# EAGLE design CapTouchMatrix (EAGLE 9.6.2)
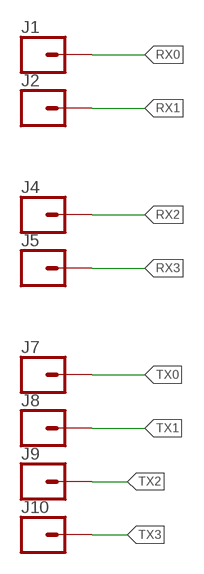
[diagram p0: schematic, sheet 1]

## Parts
J1  CONN_01  [1X01]
J2  CONN_01  [1X01]
J4  CONN_01  [1X01]
J5  CONN_01  [1X01]
J7  CONN_01  [1X01]
J8  CONN_01  [1X01]
J9  CONN_01  [1X01]
J10  CONN_01  [1X01]

## Nets
RX0: J1.1
RX1: J2.1
RX2: J4.1
RX3: J5.1
TX0: J7.1
TX1: J8.1
TX2: J9.1
TX3: J10.1

## Library data of the parts
J1 J2 J4 J5 J7-J10 = SparkFun-Connectors:CONN_01: Single connection point. Often used as Generic Header-pin footprint for 0.1 inch spaced/style header connections On any of the 0.1 inch spaced packages, you can populate with these: Break Away Headers - Straight <https://www.sparkfun.com/products/116> (PRT-00116) Break Away Male Headers - Right Angle <https://www.sparkfun.com/products/553> (PRT-00553) Female Headers <https://www.sparkfun.com/products/115> (PRT-00115) Break Away Headers - Machine Pin <https://www.sparkfun.com/products/117> (PRT-00117) Break Away Female Headers - Swiss Machine Pin <https://www.sparkfun.com/products/743> (PRT-00743) This device is also useful as a general connection point to wire up your design to another part of your project. Our various solder wires solder well into these plated through hole pads. Hook-Up Wire - Assortment (Stranded, 22 AWG) <https://www.sparkfun.com/products/11375> (PRT-11375) Hook-Up Wire - Assortment (Solid Core, 22 AWG) <https://www.sparkfun.com/products/11367> (PRT-11367) View the entire wire category on our website here <https://www.sparkfun.com/categories/141> Special notes: SMTSO-256-ET is a "flush mount" nut for a 4-40 screw. We mostly use this on specialty testbeds; it is a nice way to connect hardware to your PCB at an adjustable hieght. Also note, the SNAP packages are for using a snappable style connector. We sell a baggie of snaps and they are also used on two LilyPad designs: Snap Assortment - 30 pack (male and female) <https://www.sparkfun.com/products/11347> (DEV-11347) LilyPad Arduino SimpleSnap <https://www.sparkfun.com/products/10941> (DEV-10941) LilyPad SimpleSnap Protoboard <https://www.sparkfun.com/products/10940> (DEV-10940)

## Board
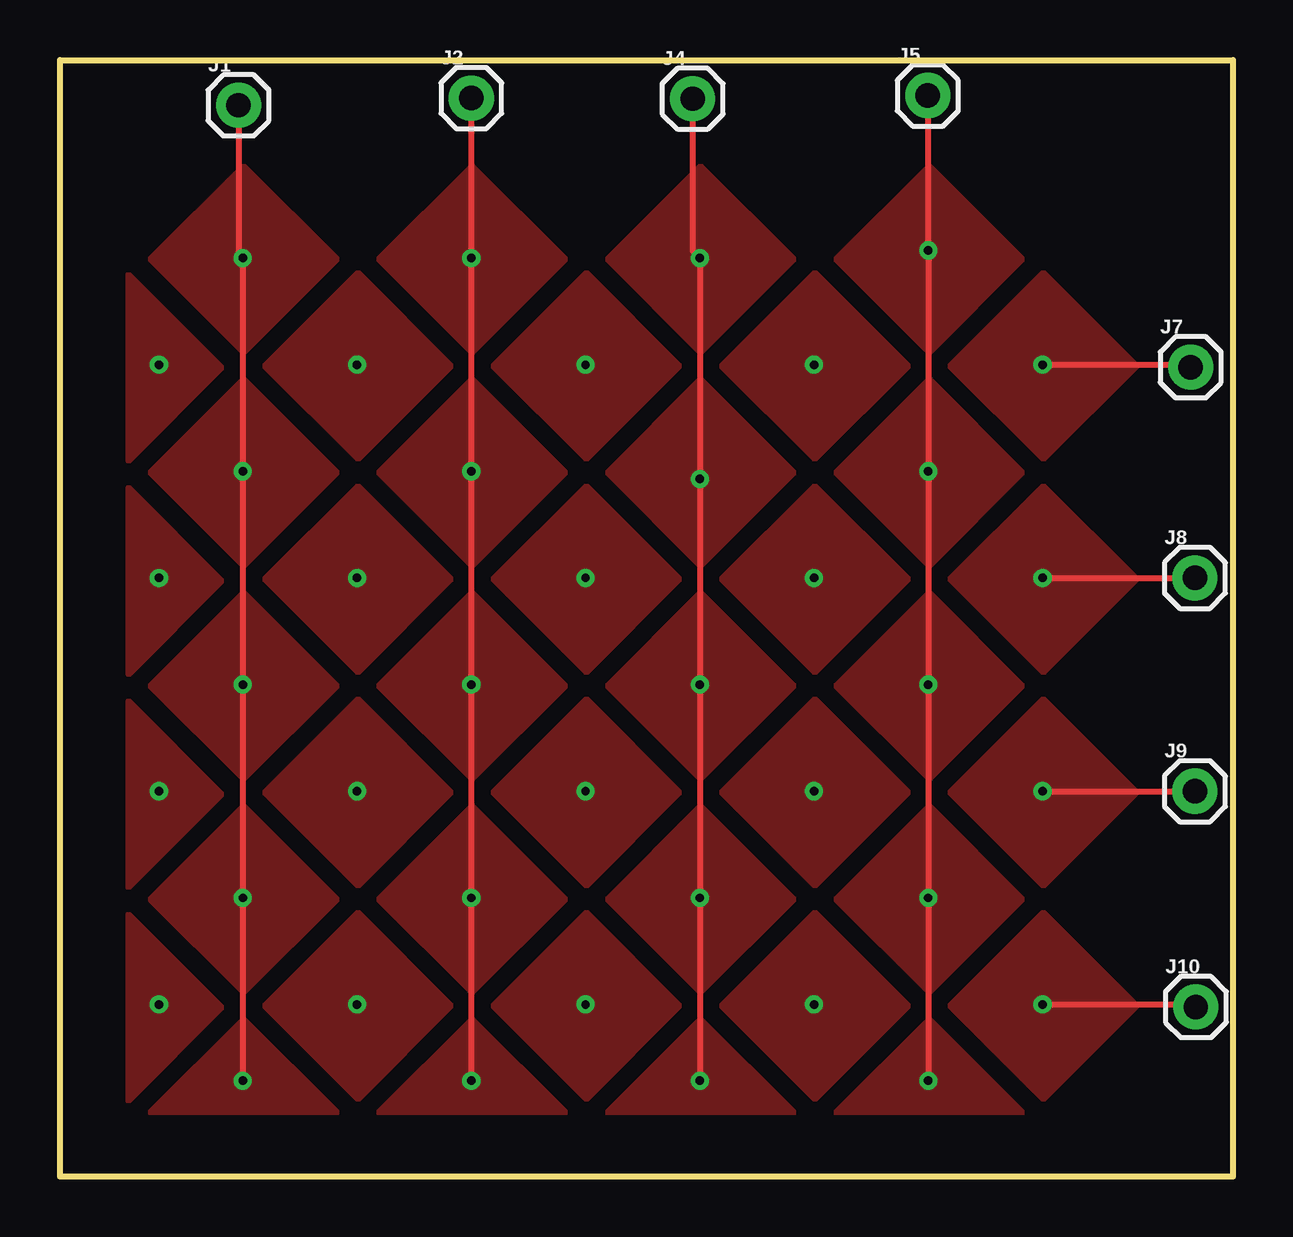
[diagram p1: board, top side]
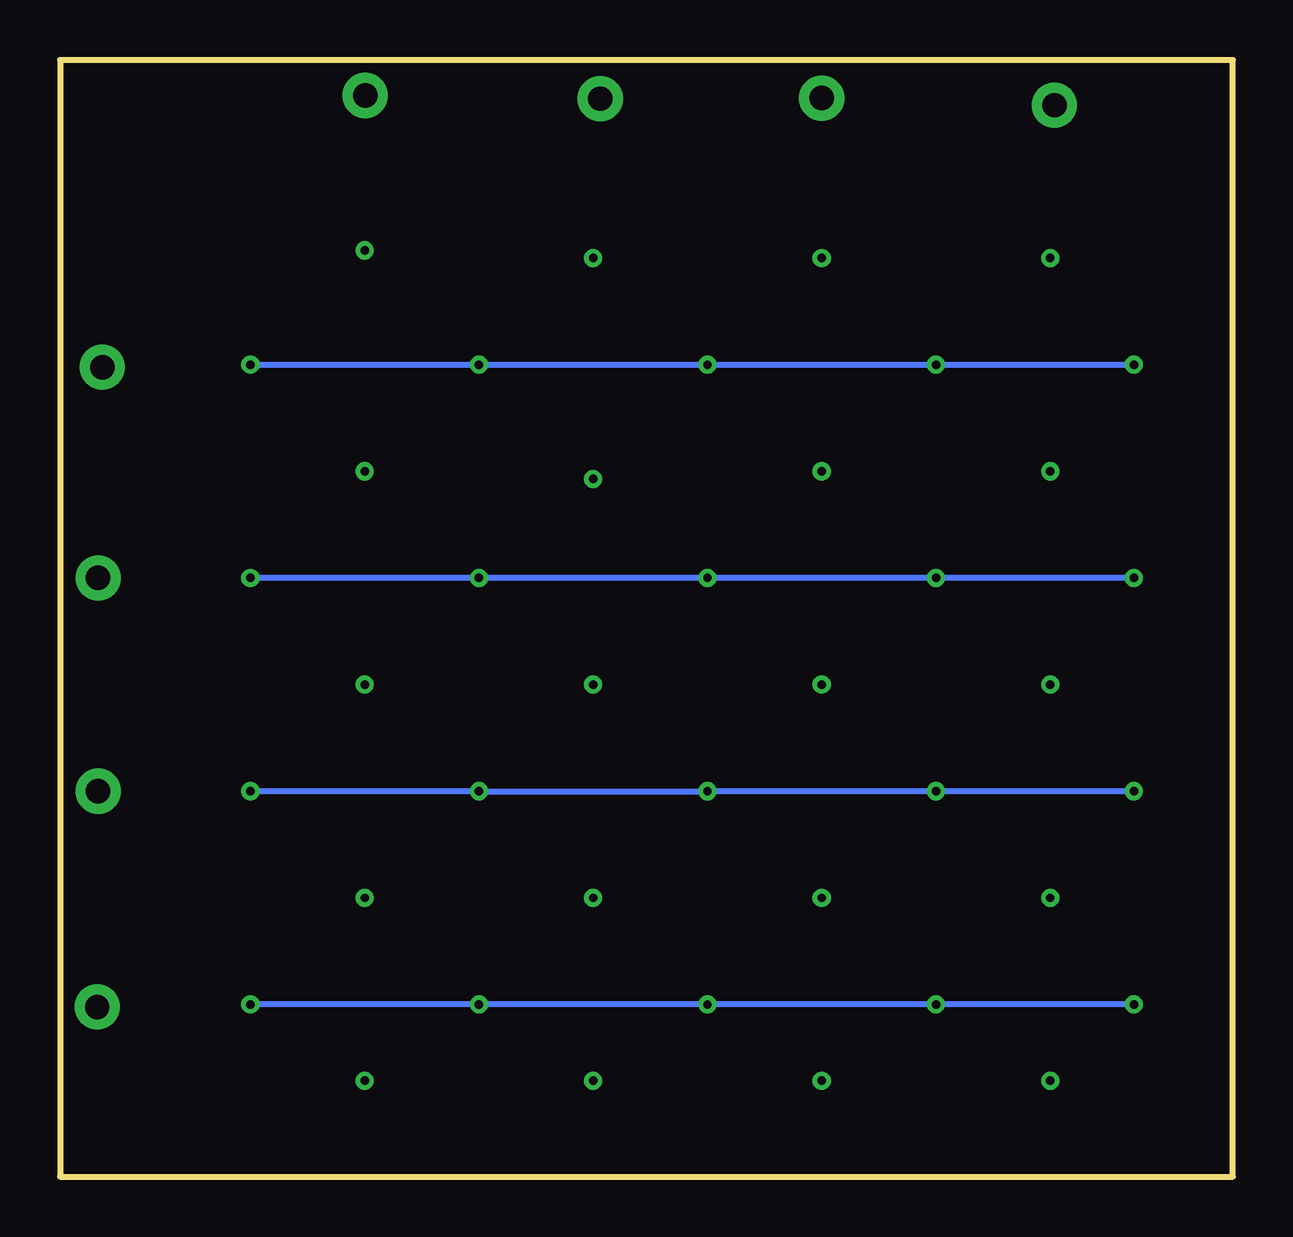
[diagram p2: board, bottom side, seen from below]

Size 48.9 x 46.54 mm. Coordinates in mm from the lower left corner, seen from the top.
Outline: 0,0 0,46.54 48.9,46.54 48.9,0 0,0
Copper layers (1*16): Top 0.035mm / dielectric 1.5mm / Bottom 0.035mm
Design rules "default": minimum track width 6mil, minimum drill 0.35mm, track to track 6mil, track to pad 6mil, pad to pad 6mil, via to via 6mil, smd to smd 6mil, copper to edge 40mil, drill to drill 6mil, minimum pad ring 10mil, minimum via ring 8mil, stop-mask expansion 4mil, vias tented up to drill 0mil, thermal gap 10mil

### Footprints (pad centres in the part's own frame; a part is rotated, then mirrored left to right if it is on the bottom)
1X01 = drill 1.016 pad 1.88: 1 0,0

### Placement (x,y rotation side)
J1  7.44,44.66 0 top
J2  17.15,44.96 0 top
J4  26.37,44.93 0 top
J5  36.17,45.06 0 top
J7  47.13,33.73 0 top
J8  47.31,24.95 0 top
J9  47.31,16.06 0 top
J10  47.34,7.07 0 top

### Tracks (layer width: path | path; a pad name or v marks a point on that pad's centre or on a via)
RX0  (via drill 0.35)
  Top 0.254: J1.1 7.44,38.47 v7.62,38.29 v7.62,29.4 v7.62,20.51 v7.62,11.62 v7.62,4
  pour Top (isolate 0.305): 7.66,34.34 3.77,38.23 7.66,42.12 11.54,38.23
  pour Top (isolate 0.305): 7.66,25.45 3.77,29.34 7.66,33.23 11.54,29.34
  pour Top (isolate 0.305): 7.66,16.56 3.77,20.45 7.66,24.34 11.54,20.45
  pour Top (isolate 0.305): 7.66,7.67 3.77,11.56 7.66,15.45 11.54,11.56
  pour Top (isolate 0.305): 3.77,2.67 7.66,6.56 11.54,2.67
RX1  (via drill 0.35)
  Top 0.254: 17.13,44.97 J2.1 v17.15,38.29 v17.15,29.4 v17.15,20.51 v17.15,11.62 v17.15,4
  pour Top (isolate 0.305): 17.18,16.56 13.29,20.45 17.18,24.34 21.07,20.45
  pour Top (isolate 0.305): 17.18,34.34 13.29,38.23 17.18,42.12 21.07,38.23
  pour Top (isolate 0.305): 17.18,7.67 13.29,11.56 17.18,15.45 21.07,11.56
  pour Top (isolate 0.305): 13.29,2.67 17.18,6.56 21.07,2.67
  pour Top (isolate 0.305): 17.18,25.45 13.29,29.34 17.18,33.23 21.07,29.34
RX2  (via drill 0.35)
  Top 0.254: J4.1 26.37,38.58 v26.67,38.29 v26.67,29.08 v26.67,20.51 v26.67,11.62 v26.67,4
  pour Top (isolate 0.305): 26.71,34.34 22.82,38.23 26.71,42.12 30.59,38.23
  pour Top (isolate 0.305): 26.71,25.45 22.82,29.34 26.71,33.23 30.59,29.34
  pour Top (isolate 0.305): 26.71,16.56 22.82,20.45 26.71,24.34 30.59,20.45
  pour Top (isolate 0.305): 26.71,7.67 22.82,11.56 26.71,15.45 30.59,11.56
  pour Top (isolate 0.305): 22.82,2.67 26.71,6.56 30.59,2.67
RX3  (via drill 0.35)
  Top 0.254: J5.1 36.17,38.63 v36.19,38.61 v36.19,29.4 v36.19,20.51 v36.19,11.62 v36.19,4
  pour Top (isolate 0.305): 36.23,34.34 32.34,38.23 36.23,42.12 40.12,38.23
  pour Top (isolate 0.305): 36.23,25.45 32.34,29.34 36.23,33.23 40.12,29.34
  pour Top (isolate 0.305): 36.23,7.67 32.34,11.56 36.23,15.45 40.12,11.56
  pour Top (isolate 0.305): 36.23,16.56 32.34,20.45 36.23,24.34 40.12,20.45
  pour Top (isolate 0.305): 32.34,2.67 36.23,6.56 40.12,2.67
TX0  (via drill 0.35)
  Top 0.254: v40.96,33.84 47.02,33.84 J7.1
  Bottom 0.254: v40.96,33.84 v31.43,33.84 v21.91,33.84 v12.38,33.84 v4.13,33.84
  pour Top (isolate 0.305): 6.75,33.71 2.86,29.83 2.86,37.6
  pour Top (isolate 0.305): 12.42,29.9 8.53,33.79 12.42,37.68 16.31,33.79
  pour Top (isolate 0.305): 21.94,29.9 18.05,33.79 21.94,37.68 25.83,33.79
  pour Top (isolate 0.305): 31.47,29.9 27.58,33.79 31.47,37.68 35.36,33.79
  pour Top (isolate 0.305): 40.99,29.9 37.1,33.79 40.99,37.68 44.88,33.79
TX1  (via drill 0.35)
  Top 0.254: v40.96,24.95 J8.1
  Bottom 0.254: v4.13,24.95 v12.38,24.95 v21.91,24.95 v31.43,24.95 v40.96,24.95
  pour Top (isolate 0.305): 40.99,21.01 37.1,24.9 40.99,28.79 44.88,24.9
  pour Top (isolate 0.305): 31.47,21.01 27.58,24.9 31.47,28.79 35.36,24.9
  pour Top (isolate 0.305): 21.94,21.01 18.05,24.9 21.94,28.79 25.83,24.9
  pour Top (isolate 0.305): 12.42,21.01 8.53,24.9 12.42,28.79 16.31,24.9
  pour Top (isolate 0.305): 6.75,24.82 2.86,20.94 2.86,28.71
TX2  (via drill 0.35)
  Top 0.254: v40.96,16.06 J9.1
  Bottom 0.254: v4.13,16.06 v12.38,16.06 v21.91,16.06 v31.43,16.06 v40.96,16.06
  pour Top (isolate 0.305): 40.99,12.12 37.1,16.01 40.99,19.9 44.88,16.01
  pour Top (isolate 0.305): 31.47,12.12 27.58,16.01 31.47,19.9 35.36,16.01
  pour Top (isolate 0.305): 21.94,12.12 18.05,16.01 21.94,19.9 25.83,16.01
  pour Top (isolate 0.305): 12.42,12.12 8.53,16.01 12.42,19.9 16.31,16.01
  pour Top (isolate 0.305): 6.75,15.93 2.86,12.05 2.86,19.82
TX3  (via drill 0.35)
  Top 0.254: v40.96,7.17 47.24,7.17 J10.1
  Bottom 0.254: v4.13,7.17 v12.38,7.17 v21.91,7.17 v31.43,7.17 v40.96,7.17
  pour Top (isolate 0.305): 31.47,3.23 27.58,7.12 31.47,11.01 35.36,7.12
  pour Top (isolate 0.305): 40.99,3.23 37.1,7.12 40.99,11.01 44.88,7.12
  pour Top (isolate 0.305): 21.94,3.23 18.05,7.12 21.94,11.01 25.83,7.12
  pour Top (isolate 0.305): 12.42,3.23 8.53,7.12 12.42,11.01 16.31,7.12
  pour Top (isolate 0.305): 6.75,7.04 2.86,3.16 2.86,10.93